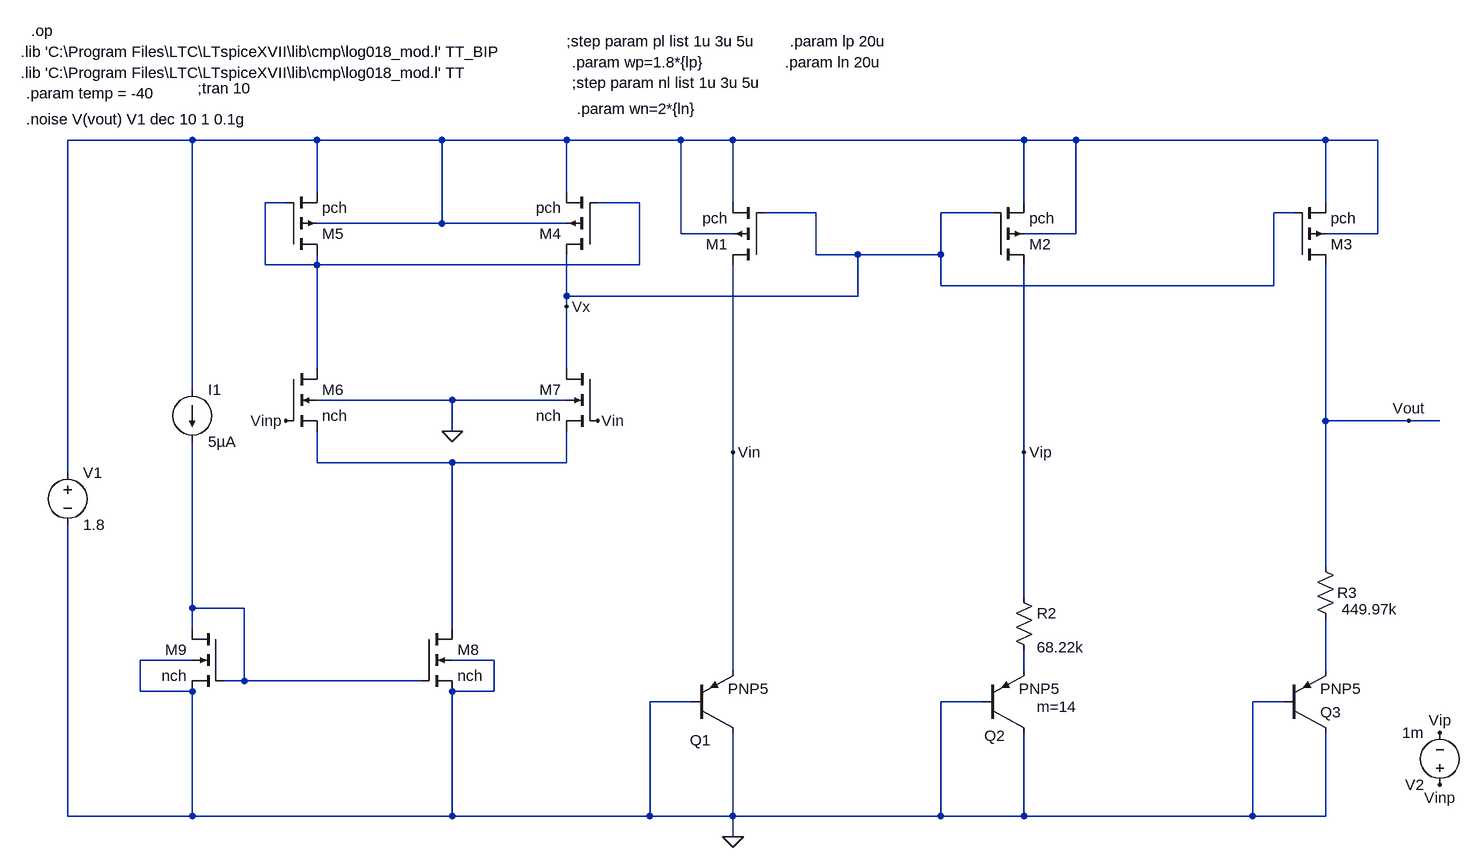
[diagram p0: schematic bandgap_e_copy.asc]
bandgap_e_copy.asc, the LTspice schematic file:
Version 4
SHEET 1 3264 2036
WIRE 16 176 -176 176
WIRE 208 176 16 176
WIRE 400 176 208 176
WIRE 592 176 400 176
WIRE 768 176 592 176
WIRE 848 176 768 176
WIRE 1296 176 848 176
WIRE 1376 176 1296 176
WIRE 1760 176 1376 176
WIRE 1840 176 1760 176
WIRE 208 256 208 176
WIRE 592 256 592 176
WIRE 160 272 128 272
WIRE 704 272 640 272
WIRE 848 272 848 176
WIRE 1296 272 1296 176
WIRE 1760 272 1760 176
WIRE 976 288 896 288
WIRE 1248 288 1168 288
WIRE 1712 288 1680 288
WIRE 400 304 400 176
WIRE 400 304 208 304
WIRE 592 304 400 304
WIRE 768 320 768 176
WIRE 848 320 768 320
WIRE 1376 320 1376 176
WIRE 1376 320 1296 320
WIRE 1840 320 1840 176
WIRE 1840 320 1760 320
WIRE 976 352 976 288
WIRE 1040 352 976 352
WIRE 1168 352 1168 288
WIRE 1168 352 1040 352
WIRE 128 368 128 272
WIRE 208 368 208 352
WIRE 208 368 128 368
WIRE 704 368 704 272
WIRE 704 368 208 368
WIRE 1168 400 1168 352
WIRE 1680 400 1680 288
WIRE 1680 400 1168 400
WIRE 592 416 592 352
WIRE 1040 416 1040 352
WIRE 1040 416 592 416
WIRE 592 432 592 416
WIRE 208 528 208 368
WIRE 592 528 592 432
WIRE 16 560 16 176
WIRE 416 576 208 576
WIRE 592 576 416 576
WIRE 1760 608 1760 368
WIRE 1888 608 1760 608
WIRE 1936 608 1888 608
WIRE 416 624 416 576
WIRE 848 656 848 368
WIRE 1296 656 1296 368
WIRE 208 672 208 624
WIRE 416 672 208 672
WIRE 592 672 592 624
WIRE 592 672 416 672
WIRE -176 688 -176 176
WIRE 1760 832 1760 608
WIRE 1296 880 1296 656
WIRE 16 896 16 640
WIRE 96 896 16 896
WIRE 16 928 16 896
WIRE 416 928 416 672
WIRE 16 976 -64 976
WIRE 480 976 416 976
WIRE 848 992 848 656
WIRE 1296 992 1296 960
WIRE 1760 992 1760 912
WIRE 96 1008 96 896
WIRE 96 1008 64 1008
WIRE 368 1008 96 1008
WIRE -64 1024 -64 976
WIRE 16 1024 -64 1024
WIRE 480 1024 480 976
WIRE 480 1024 416 1024
WIRE 784 1040 720 1040
WIRE 1232 1040 1168 1040
WIRE 1696 1040 1648 1040
WIRE -176 1216 -176 768
WIRE 16 1216 16 1024
WIRE 16 1216 -176 1216
WIRE 416 1216 416 1024
WIRE 416 1216 16 1216
WIRE 720 1216 720 1040
WIRE 720 1216 416 1216
WIRE 848 1216 848 1088
WIRE 848 1216 720 1216
WIRE 1168 1216 1168 1040
WIRE 1168 1216 848 1216
WIRE 1296 1216 1296 1088
WIRE 1296 1216 1168 1216
WIRE 1648 1216 1648 1040
WIRE 1648 1216 1296 1216
WIRE 1760 1216 1760 1088
WIRE 1760 1216 1648 1216
WIRE 848 1248 848 1216
FLAG 848 1248 0
FLAG 1888 608 Vout
FLAG 1296 656 Vip
FLAG 848 656 Vin
FLAG 416 624 0
FLAG 160 608 Vinp
FLAG 640 608 Vin
FLAG 592 432 Vx
FLAG 1936 1088 Vip
FLAG 1936 1168 Vinp
SYMBOL pnp2 784 1088 M180
WINDOW 0 -2 -11 Left 2
SYMATTR InstName Q1
SYMATTR Value PNP5
SYMBOL pnp2 1232 1088 M180
WINDOW 123 84 40 Left 2
WINDOW 0 3 -4 Left 2
SYMATTR Value2 m=14
SYMATTR InstName Q2
SYMATTR Value PNP5
SYMBOL voltage -176 672 R0
WINDOW 123 0 0 Left 0
WINDOW 39 0 0 Left 0
SYMATTR InstName V1
SYMATTR Value 1.8
SYMBOL pmos4 896 368 R180
SYMATTR InstName M1
SYMATTR Value pch
SYMATTR Value2 l=21u w=60u
SYMBOL pmos4 1248 368 M180
SYMATTR InstName M2
SYMATTR Value pch
SYMATTR Value2 l=21u w=60u
SYMBOL res 1280 864 R0
WINDOW 3 36 92 Left 2
SYMATTR Value 68.22k
SYMATTR InstName R2
SYMBOL pmos4 1712 368 M180
SYMATTR InstName M3
SYMATTR Value pch
SYMATTR Value2 l=21u w=60u
SYMBOL res 1744 816 R0
WINDOW 0 34 56 Left 2
WINDOW 3 41 82 Left 2
SYMATTR InstName R3
SYMATTR Value 449.97k
SYMBOL pnp2 1696 1088 M180
SYMATTR InstName Q3
SYMATTR Value PNP5
SYMBOL pmos4 640 352 R180
SYMATTR InstName M4
SYMATTR Value2 l={pl} w={pw}
SYMATTR Value pch
SYMBOL pmos4 160 352 M180
SYMATTR InstName M5
SYMATTR Value2 l={pl} w={pw}
SYMATTR Value pch
SYMBOL nmos4 160 528 R0
SYMATTR InstName M6
SYMATTR Value2 l={nl} w={nw}
SYMATTR Value nch
SYMBOL nmos4 640 528 M0
SYMATTR InstName M7
SYMATTR Value2 l={nl} w={nw}
SYMATTR Value nch
SYMBOL nmos4 368 928 R0
SYMATTR InstName M8
SYMATTR Value2 l={nl} w={nw}
SYMATTR Value nch
SYMBOL nmos4 64 928 M0
SYMATTR InstName M9
SYMATTR Value2 l={nl} w={nw}
SYMATTR Value nch
SYMBOL current 16 560 R0
WINDOW 123 0 0 Left 0
WINDOW 39 0 0 Left 0
SYMATTR InstName I1
SYMATTR Value 5µA
SYMBOL voltage 1936 1184 R180
WINDOW 123 0 0 Left 0
WINDOW 39 0 0 Left 0
SYMATTR InstName V2
SYMATTR Value 1m
TEXT -248 72 Left 2 !.lib 'C:\\Program Files\\LTC\\LTspiceXVII\\lib\\cmp\\log018_mod.l' TT
TEXT -248 40 Left 2 !.lib 'C:\\Program Files\\LTC\\LTspiceXVII\\lib\\cmp\\log018_mod.l' TT_BIP
TEXT -232 8 Left 2 !.op
TEXT -240 104 Left 2 !.param temp = -40
TEXT 24 96 Left 2 !;tran 10
TEXT -240 144 Left 2 !.noise V(vout) V1 dec 10 1 0.1g
TEXT 592 24 Left 2 !;step param pl list 1u 3u 5u
TEXT 600 56 Left 2 !.param wp=1.8*{lp}
TEXT 600 88 Left 2 !;step param nl list 1u 3u 5u
TEXT 608 128 Left 2 !.param wn=2*{ln}
TEXT 936 24 Left 2 !.param lp 20u
TEXT 928 56 Left 2 !.param ln 20u

The netlist it stands for:
* bandgap_e_copy.asc
Q1 0 0 Vin 0 PNP5
Q2 0 0 N005 0 PNP5 m=14
V1 N001 0 1.8
M1 Vin Vx N001 N001 pch l=21u w=60u
M2 Vip Vx N001 N001 pch l=21u w=60u
R2 Vip N005 68.22k
M3 Vout Vx N001 N001 pch l=21u w=60u
R3 Vout N006 449.97k
Q3 0 0 N006 0 PNP5
M4 Vx N002 N001 N001 pch l={pl} w={pw}
M5 N002 N002 N001 N001 pch l={pl} w={pw}
M6 N002 Vinp N003 0 nch l={nl} w={nw}
M7 Vx Vin N003 0 nch l={nl} w={nw}
M8 N003 N004 0 0 nch l={nl} w={nw}
M9 N004 N004 0 0 nch l={nl} w={nw}
I1 N001 N004 5µA
V2 Vinp Vip 1m
.model NPN NPN
.model PNP PNP
.lib standard.bjt
.model NMOS NMOS
.model PMOS PMOS
.lib standard.mos
.lib 'C:\Program Files\LTC\LTspiceXVII\lib\cmp\log018_mod.l' TT
.lib 'C:\Program Files\LTC\LTspiceXVII\lib\cmp\log018_mod.l' TT_BIP
.op
.param temp = -40
;tran 10
.noise V(vout) V1 dec 10 1 0.1g
;step param pl list 1u 3u 5u
.param wp=1.8*{lp}
;step param nl list 1u 3u 5u
.param wn=2*{ln}
.param lp 20u
.param ln 20u
.backanno
.end